# EAGLE schematic Zeus v2 (EAGLE 7.4.0)
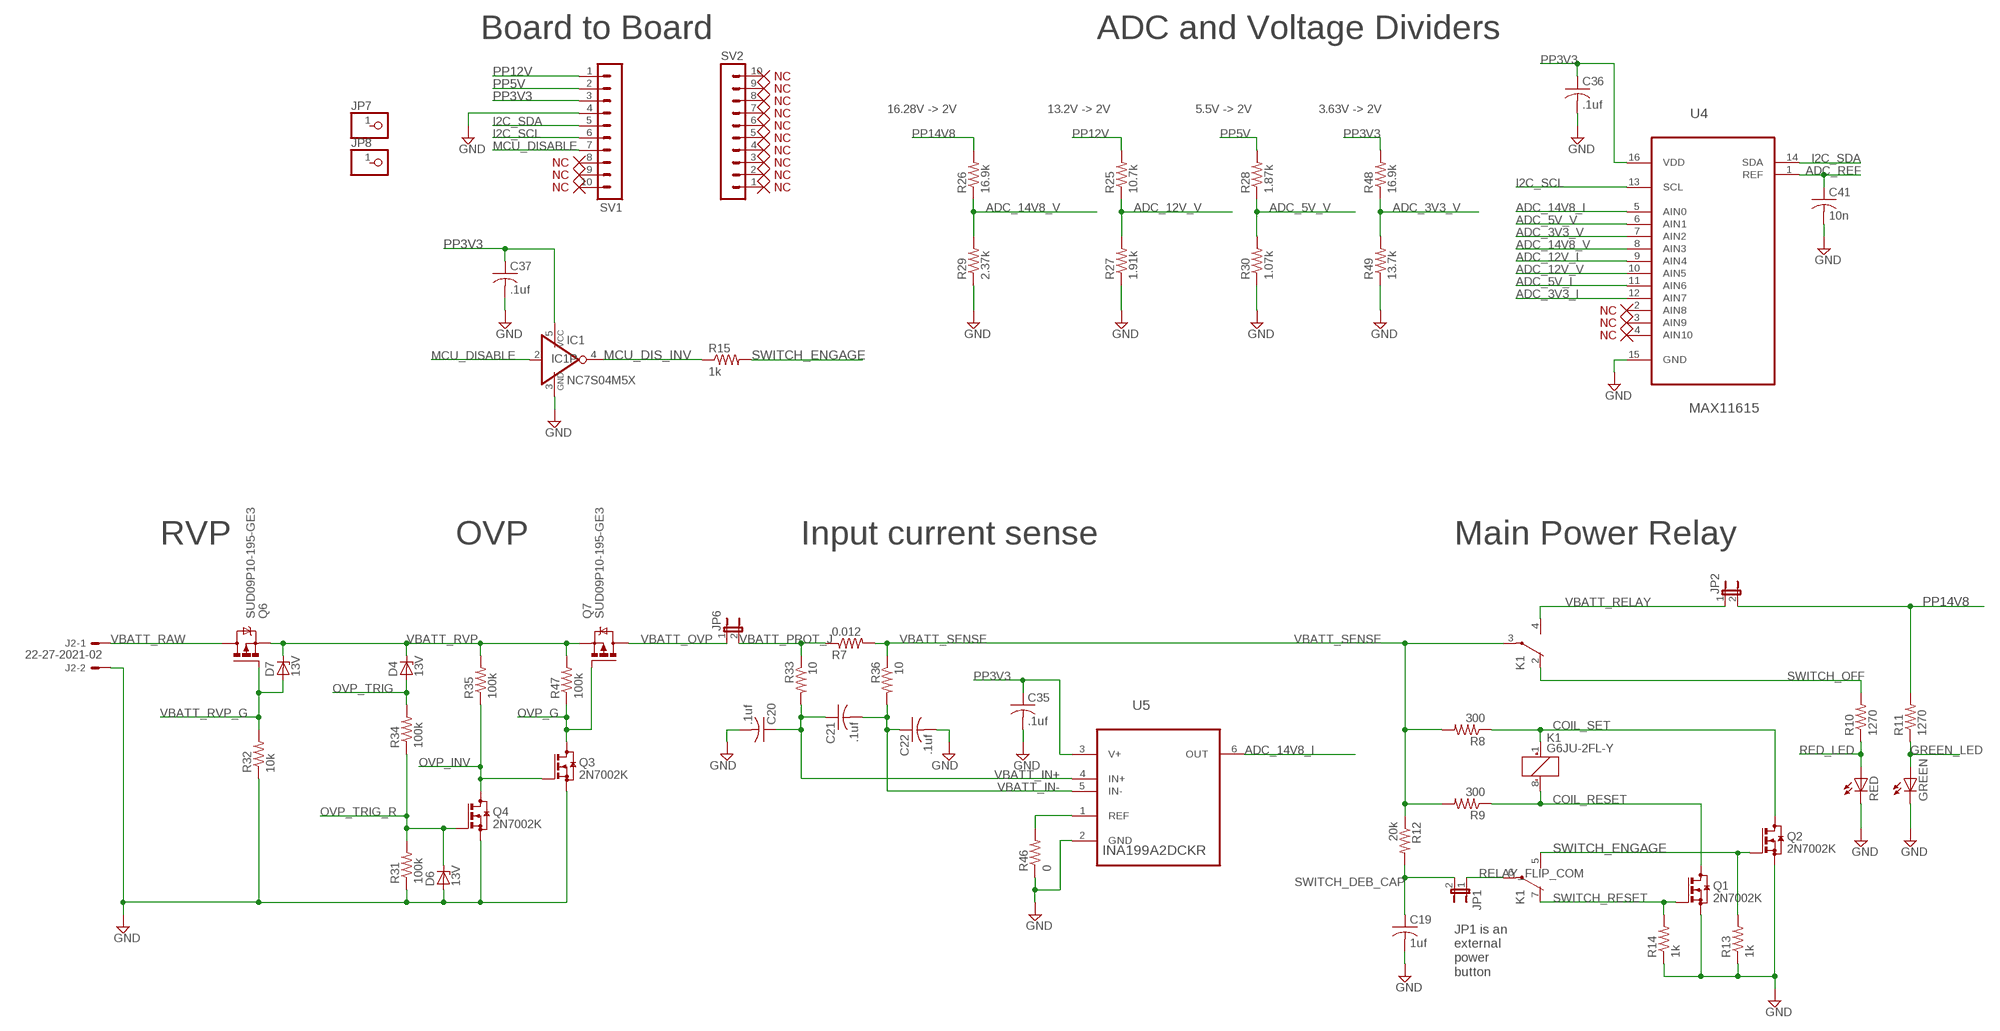
[diagram p0: schematic, sheet 1, part 1 of 2]
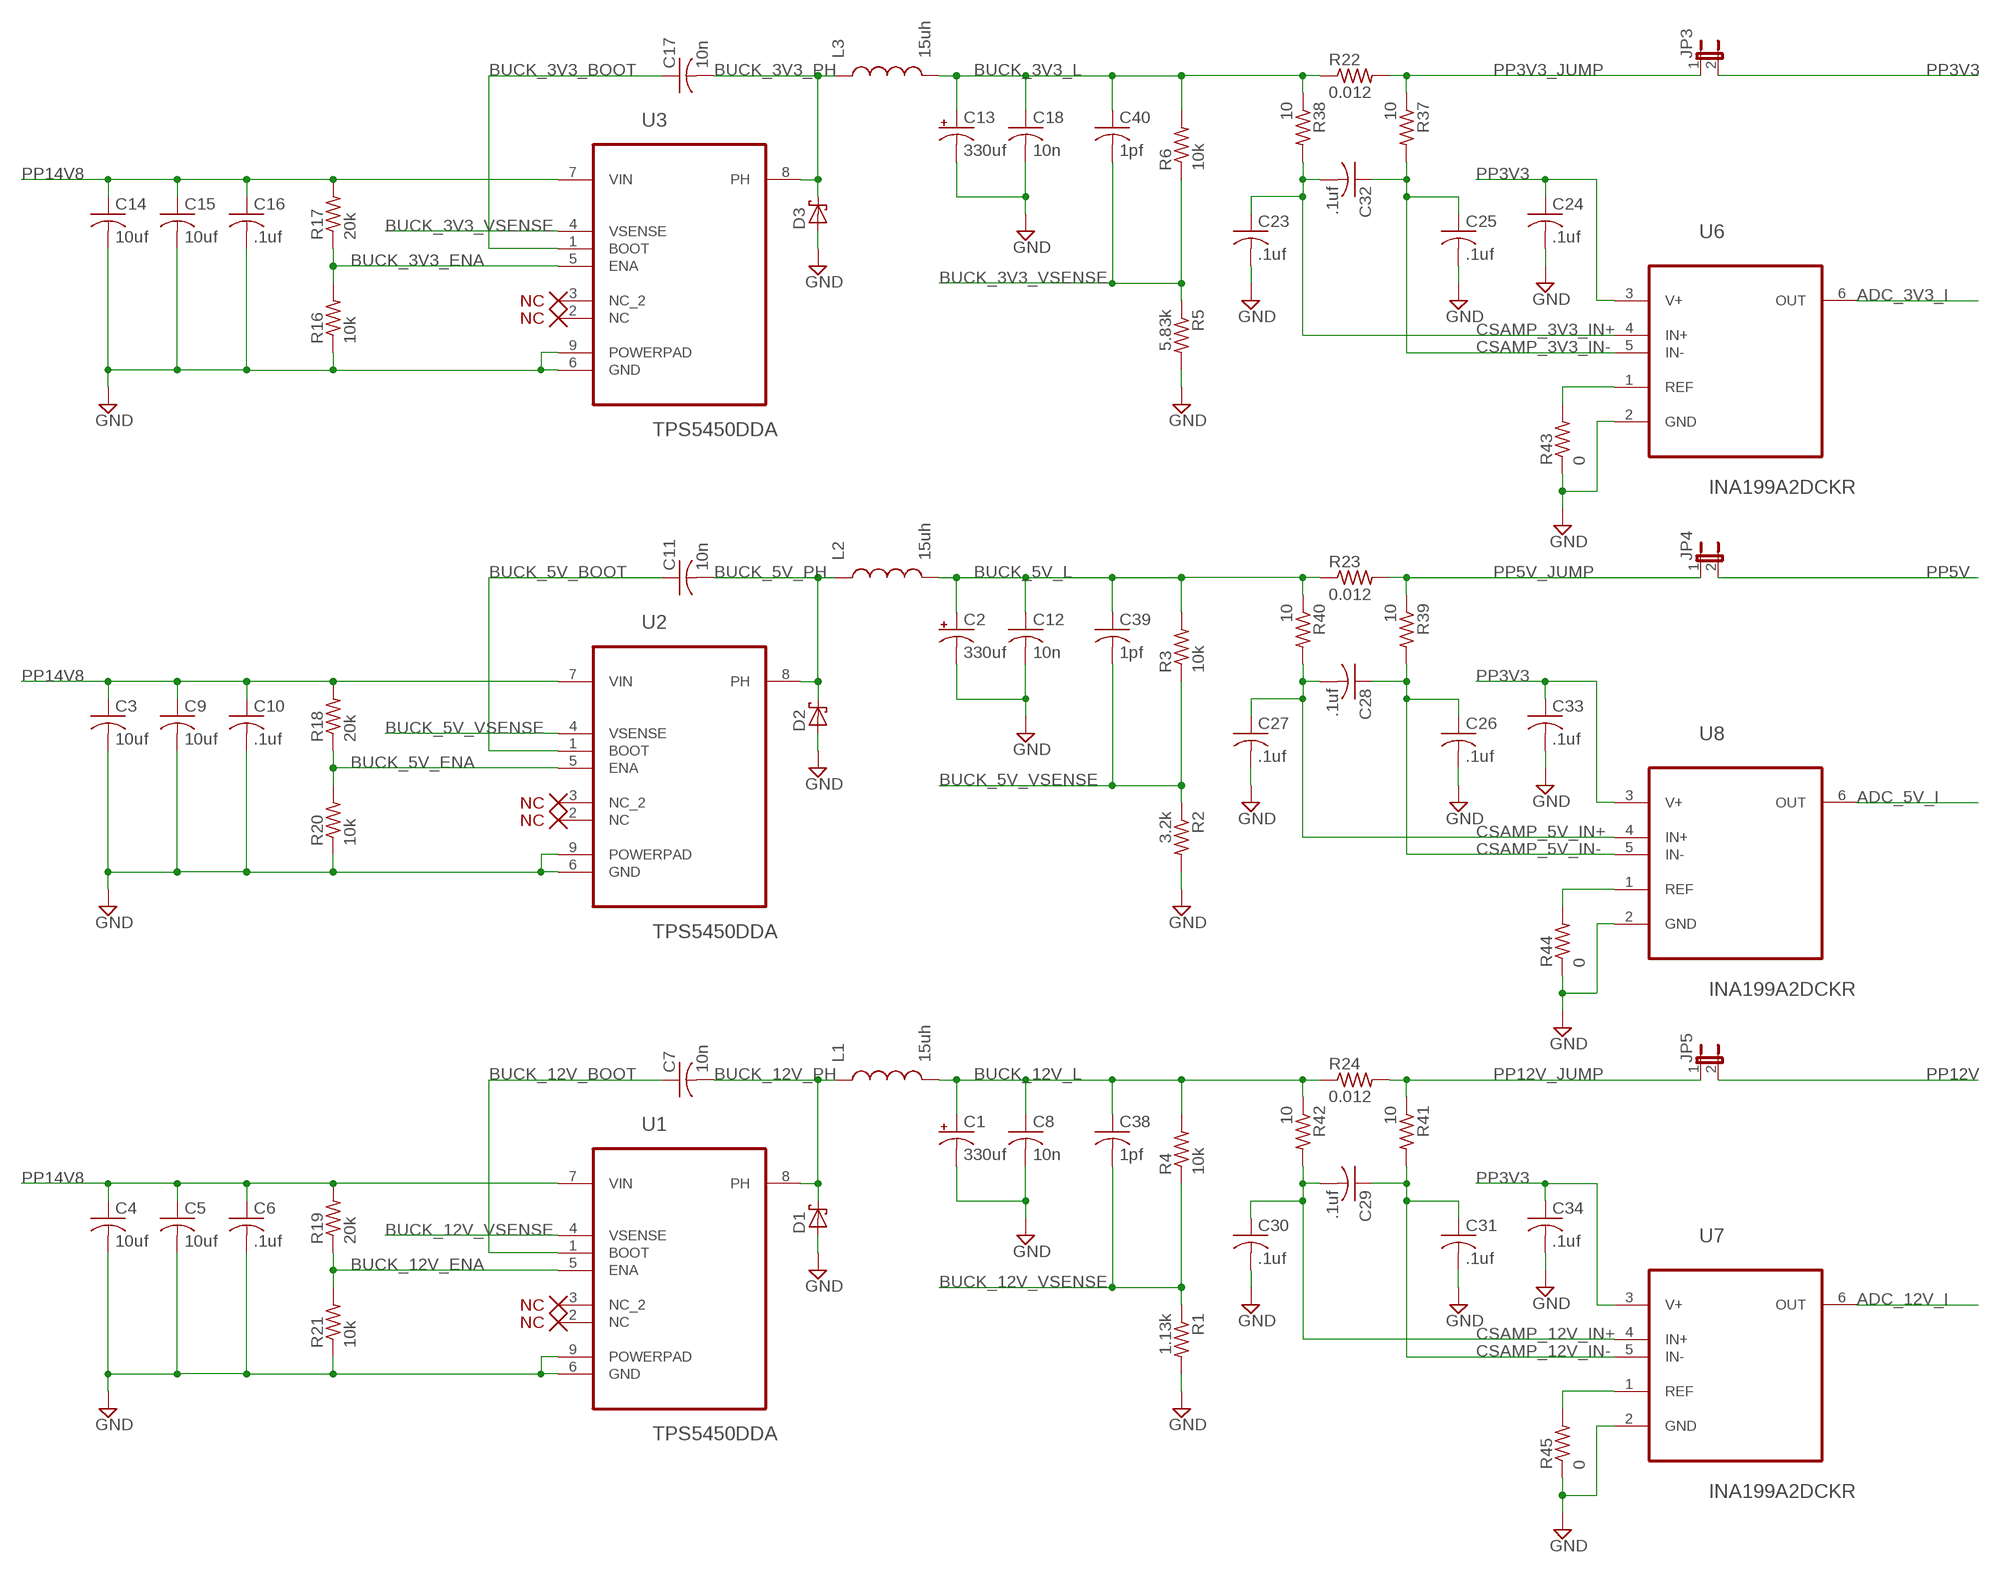
[diagram p1: schematic, sheet 1, part 2 of 2]

## Parts
C1  330uf  CPOL-US153CLV-0605  [153CLV-0605]
C2  330uf  CPOL-US153CLV-0605  [153CLV-0605]
C3  10uf  C-USC1206  [C1206]
C4  10uf  C-USC1206  [C1206]
C5  10uf  C-USC1206  [C1206]
C6  .1uf  C-USC0402  [C0402]
C7  10n  C-USC0402  [C0402]
C8  10n  C-USC0402  [C0402]
C9  10uf  C-USC1206  [C1206]
C10  .1uf  C-USC0402  [C0402]
C11  10n  C-USC0402  [C0402]
C12  10n  C-USC0402  [C0402]
C13  330uf  CPOL-US153CLV-0605  [153CLV-0605]
C14  10uf  C-USC1206  [C1206]
C15  10uf  C-USC1206  [C1206]
C16  .1uf  C-USC0402  [C0402]
C17  10n  C-USC0402  [C0402]
C18  10n  C-USC0402  [C0402]
C19  1uf  C-USC0603  [C0603]
C20  .1uf  C-USC0402  [C0402]
C21  .1uf  C-USC0402  [C0402]
C22  .1uf  C-USC0402  [C0402]
C23  .1uf  C-USC0402  [C0402]
C24  .1uf  C-USC0402  [C0402]
C25  .1uf  C-USC0402  [C0402]
C26  .1uf  C-USC0402  [C0402]
C27  .1uf  C-USC0402  [C0402]
C28  .1uf  C-USC0402  [C0402]
C29  .1uf  C-USC0402  [C0402]
C30  .1uf  C-USC0402  [C0402]
C31  .1uf  C-USC0402  [C0402]
C32  .1uf  C-USC0402  [C0402]
C33  .1uf  C-USC0402  [C0402]
C34  .1uf  C-USC0402  [C0402]
C35  .1uf  C-USC0402  [C0402]
C36  .1uf  C-USC0402  [C0402]
C37  .1uf  C-USC0402  [C0402]
C38  1pf  C-USC0402  [C0402]
C39  1pf  C-USC0402  [C0402]
C40  1pf  C-USC0402  [C0402]
C41  10n  C-USC0402  [C0402]
D1  SCHOTTKY-DIODESMC  [SMC]
D2  SCHOTTKY-DIODESMC  [SMC]
D3  SCHOTTKY-DIODESMC  [SMC]
D4  13V  ZENER-DIODESOT23  [SOT23]
D6  13V  ZENER-DIODESOT23  [SOT23]
D7  13V  ZENER-DIODESOT23  [SOT23]
GREEN  LED_ESML0603  [LED_SML0603]
IC1  NC7S04M5X  74AUC1G06DBV  [SOT23-5]
J2  22-27-2021-02  [6410-02]
JP1  JP1E  [JP1]
JP2  JP1E  [JP1]
JP3  JP1E  [JP1]
JP4  JP1E  [JP1]
JP5  JP1E  [JP1]
JP6  JP1E  [JP1]
JP7  PINHD-1X1  [1X01]
JP8  PINHD-1X1  [1X01]
K1  G6JU-2FL-Y  [G6J-2FL-Y]
L1  15uh  INDUCTOR  [SUMIDA]
L2  15uh  INDUCTOR  [SUMIDA]
L3  15uh  INDUCTOR  [SUMIDA]
Q1  2N7002K  BSS123  [SOT23]
Q2  2N7002K  BSS123  [SOT23]
Q3  2N7002K  BSS123  [SOT23]
Q4  2N7002K  BSS123  [SOT23]
Q6  SUD09P10-195-GE3  IRFR5305  [D-PAK_TO252AA]
Q7  SUD09P10-195-GE3  IRFR5305  [D-PAK_TO252AA]
R1  1.13k  R-US_R0603  [R0603]
R2  3.2k  R-US_R0603  [R0603]
R3  10k  R-US_R0603  [R0603]
R4  10k  R-US_R0603  [R0603]
R5  5.83k  R-US_R0603  [R0603]
R6  10k  R-US_R0603  [R0603]
R7  0.012  R-US_R0805  [R0805]
R8  300  R-US_R0603  [R0603]
R9  300  R-US_R0603  [R0603]
R10  1270  R-US_R0603  [R0603]
R11  1270  R-US_R0603  [R0603]
R12  20k  R-US_R0603  [R0603]
R13  1k  R-US_R0603  [R0603]
R14  1k  R-US_R0603  [R0603]
R15  1k  R-US_R0603  [R0603]
R16  10k  R-US_R0603  [R0603]
R17  20k  R-US_R0603  [R0603]
R18  20k  R-US_R0603  [R0603]
R19  20k  R-US_R0603  [R0603]
R20  10k  R-US_R0603  [R0603]
R21  10k  R-US_R0603  [R0603]
R22  0.012  R-US_R0805  [R0805]
R23  0.012  R-US_R0805  [R0805]
R24  0.012  R-US_R0805  [R0805]
R25  10.7k  R-US_R0603  [R0603]
R26  16.9k  R-US_R0603  [R0603]
R27  1.91k  R-US_R0603  [R0603]
R28  1.87k  R-US_R0603  [R0603]
R29  2.37k  R-US_R0603  [R0603]
R30  1.07k  R-US_R0603  [R0603]
R31  100k  R-US_R0603  [R0603]
R32  10k  R-US_R0603  [R0603]
R33  10  R-US_R0603  [R0603]
R34  100k  R-US_R0603  [R0603]
R35  100k  R-US_R0603  [R0603]
R36  10  R-US_R0603  [R0603]
R37  10  R-US_R0603  [R0603]
R38  10  R-US_R0603  [R0603]
R39  10  R-US_R0603  [R0603]
R40  10  R-US_R0603  [R0603]
R41  10  R-US_R0603  [R0603]
R42  10  R-US_R0603  [R0603]
R43  0  R-US_R0603  [R0603]
R44  0  R-US_R0603  [R0603]
R45  0  R-US_R0603  [R0603]
R46  0  R-US_R0603  [R0603]
R47  100k  R-US_R0603  [R0603]
R48  16.9k  R-US_R0603  [R0603]
R49  13.7k  R-US_R0603  [R0603]
RED  LED_ESML0603  [LED_SML0603]
SV1  MA10-1  [MA10-1]
SV2  MA10-1  [MA10-1]
U1  TPS5450DDA  [SOIC127P600X170-9N]
U2  TPS5450DDA  [SOIC127P600X170-9N]
U3  TPS5450DDA  [SOIC127P600X170-9N]
U4  MAX11615  MAX11602EEE+T  [SOP63P600X175-16N]
U5  INA199A2DCKR  [SOT65P210X110-6N]
U6  INA199A2DCKR  [SOT65P210X110-6N]
U7  INA199A2DCKR  [SOT65P210X110-6N]
U8  INA199A2DCKR  [SOT65P210X110-6N]

## Nets
ADC_3V3_I: U4.12(AIN7) U6.6(OUT)
ADC_3V3_V: R48.1 R49.2 U4.7(AIN2)
ADC_5V_I: U4.11(AIN6) U8.6(OUT)
ADC_5V_V: R28.1 R30.2 U4.6(AIN1)
ADC_12V_I: U4.9(AIN4) U7.6(OUT)
ADC_12V_V: R25.1 R27.2 U4.10(AIN5)
ADC_14V8_I: U4.5(AIN0) U5.6(OUT)
ADC_14V8_V: R26.1 R29.2 U4.8(AIN3)
ADC_REF: C41.1 U4.1(REF)
BUCK_3V3_BOOT: C17.1 U3.1(BOOT)
BUCK_3V3_ENA: R16.2 R17.1 U3.5(ENA)
BUCK_3V3_L: C13.+ C18.1 C40.1 L3.P$2 R6.2 R22.1 R38.1
BUCK_3V3_PH: C17.2 D3.C L3.P$1 U3.8(PH)
BUCK_3V3_VSENSE: C40.2 R5.1 R6.1 U3.4(VSENSE)
BUCK_5V_BOOT: C11.1 U2.1(BOOT)
BUCK_5V_ENA: R18.1 R20.2 U2.5(ENA)
BUCK_5V_L: C2.+ C12.1 C39.1 L2.P$2 R3.2 R23.1 R40.1
BUCK_5V_PH: C11.2 D2.C L2.P$1 U2.8(PH)
BUCK_5V_VSENSE: C39.2 R2.1 R3.1 U2.4(VSENSE)
BUCK_12V_BOOT: C7.1 U1.1(BOOT)
BUCK_12V_ENA: R19.1 R21.2 U1.5(ENA)
BUCK_12V_L: C1.+ C8.1 C38.1 L1.P$2 R4.2 R24.1 R42.1
BUCK_12V_PH: C7.2 D1.C L1.P$1 U1.8(PH)
BUCK_12V_VSENSE: C38.2 R1.1 R4.1 U1.4(VSENSE)
COIL_RESET: K1.8(1:-) Q1.3(D) R9.1
COIL_SET: K1.1(1:+) Q2.3(D) R8.1
CSAMP_3V3_IN+: C23.1 C32.2 R38.2 U6.4(IN+)
CSAMP_3V3_IN-: C25.1 C32.1 R37.2 U6.5(IN-)
CSAMP_3V3_REF: R43.2 U6.1(REF)
CSAMP_5V_IN+: C27.1 C28.2 R40.2 U8.4(IN+)
CSAMP_5V_IN-: C26.1 C28.1 R39.2 U8.5(IN-)
CSAMP_5V_REF: R44.2 U8.1(REF)
CSAMP_12V_IN+: C29.2 C30.1 R42.2 U7.4(IN+)
CSAMP_12V_IN-: C29.1 C31.1 R41.2 U7.5(IN-)
CSAMP_12V_REF: R45.2 U7.1(REF)
GND: C1.- C2.- C3.2 C4.2 C5.2 C6.2 C8.2 C9.2 C10.2 C12.2 C13.- C14.2 C15.2 C16.2 C18.2 C19.2 C20.2 C22.2 C23.2 C24.2 C25.2 C26.2 C27.2 C30.2 C31.2 C33.2 C34.2 C35.2 C36.2 C37.2 C41.2 D1.A D2.A D3.A D6.1(A) GREEN.C IC1.3(GND) J2.2 Q1.2(S) Q2.2(S) Q3.2(S) Q4.2(S) R1.2 R2.2 R5.2 R13.1 R14.1 R16.1 R20.1 R21.1 R27.1 R29.1 R30.1 R31.1 R32.1 R43.1 R44.1 R45.1 R46.1 R49.1 RED.C SV1.4 U1.6(GND) U1.9(POWERPAD) U2.6(GND) U2.9(POWERPAD) U3.6(GND) U3.9(POWERPAD) U4.15(GND) U5.2(GND) U6.2(GND) U7.2(GND) U8.2(GND)
GREEN_LED: GREEN.A R11.1
I2C_SCL: SV1.6 U4.13(SCL)
I2C_SDA: SV1.5 U4.14(SDA)
MCU_DIS_INV: IC1.4(O) R15.1
MCU_DISABLE: IC1.2(I) SV1.7
OPAMP_REF1: R46.2 U5.1(REF)
OVP_G: Q3.3(D) Q7.1(G) R47.1
OVP_INV: Q3.1(G) Q4.3(D) R35.1
OVP_TRIG: D4.1(A) R34.2
OVP_TRIG_R: D6.3(C) Q4.1(G) R31.2 R34.1
PP3V3: C24.1 C33.1 C34.1 C35.1 C36.1 C37.1 IC1.5(VCC) JP3.2 R48.2 SV1.3 U4.16(VDD) U5.3(V+) U6.3(V+) U7.3(V+) U8.3(V+)
PP3V3_JUMP: JP3.1 R22.2 R37.1
PP5V: JP4.2 R28.2 SV1.2
PP5V_JUMP: JP4.1 R23.2 R39.1
PP12V: JP5.2 R25.2 SV1.1
PP12V_JUMP: JP5.1 R24.2 R41.1
PP14V8: C3.1 C4.1 C5.1 C6.1 C9.1 C10.1 C14.1 C15.1 C16.1 JP2.2 R11.2 R17.2 R18.2 R19.2 R26.2 U1.7(VIN) U2.7(VIN) U3.7(VIN)
RED_LED: R10.1 RED.A
RELAY_FLIP_COM: JP1.1 K1.6(3:P)
SWITCH_DEB_CAP: C19.1 JP1.2 R12.2
SWITCH_ENGAGE: K1.5(3:S) Q2.1(G) R13.2 R15.2
SWITCH_OFF: K1.2(2:O) R10.2
SWITCH_RESET: K1.7(3:O) Q1.1(G) R14.2
VBATT_IN+: C20.1 C21.1 R33.2 U5.4(IN+)
VBATT_IN-: C21.2 C22.1 R36.2 U5.5(IN-)
VBATT_OVP: JP6.1 Q7.4(D)
VBATT_PROT_J: JP6.2 R7.1 R33.1
VBATT_RAW: J2.1 Q6.4(D)
VBATT_RELAY: JP2.1 K1.4(2:S)
VBATT_RVP: D4.3(C) D7.3(C) Q6.3(S) Q7.3(S) R35.2 R47.2
VBATT_RVP_G: D7.1(A) Q6.1(G) R32.2
VBATT_SENSE: K1.3(2:P) R7.2 R8.2 R9.2 R12.1 R36.1
Unconnected: JP7.1 JP8.1 SV1.8 SV1.9 SV1.10 SV2.1 SV2.2 SV2.3 SV2.4 SV2.5 SV2.6 SV2.7 SV2.8 SV2.9 SV2.10 U1.2(NC) U1.3(NC_2) U2.2(NC) U2.3(NC_2) U3.2(NC) U3.3(NC_2) U4.2(AIN8) U4.3(AIN9) U4.4(AIN10)

## Notes on the sheet
- Board to Board | ADC and Voltage Dividers
- 16.28V -> 2V | 13.2V -> 2V | 5.5V -> 2V | 3.63V -> 2V
- RVP | OVP | Input current sense | Main Power Relay
- JP1 is an 
  external 
  power 
  button

## Library data of the parts
C1 C2 C13 = rcl:CPOL-US: POLARIZED CAPACITOR, American symbol
C3-C12 C14-C41 = rcl:C-US: CAPACITOR, American symbol
D1-D3 = diode:SCHOTTKY-DIODE: Schottky Diode
D4 D6 D7 = diode:ZENER-DIODE: Z-Diode
GREEN RED = eagle-ltspice:LED_E: LED Source: http://www.osram.convergy.de Source: www.luxeon.com Source: www.kingbright.com; SPICEMODEL: NONE; SPICEPREFIX: D; SPICETYPE: diode
IC1 = 74xx-little-de:74*1G06: Single Inverter Buffer/Driver With Open-Drain Output
J2 = con-molex:22-?-02: CONNECTOR wire to board 2.54 mm (.1 inch) pitch header; OC_FARNELL: unknown; OC_NEWARK: unknown
JP1-JP6 = jumper:JP1E: JUMPER
JP7 JP8 = pinhead:PINHD-1X1: PIN HEADER
K1 = relay:G6J*-2?-Y: Surface-Mounting Signal Relay - G6J-Y 5.7 x 10.6 x 9 mm Source: http://www.omroncomponents.eu/ .. K125-E2-02-X.pdf; MPN: G6JU-2FL-Y DC3; OC_FARNELL: unknown; OC_NEWARK: 04M9916
L1-L3 = CUSTOM:INDUCTOR
Q1-Q4 = transistor-small-signal:BSS123: N-CHANNEL MOS FET
Q6 Q7 = transistor-power:IRF?5305: HEXFET Power MOSFET Source: http://www.irf.com/product-info/datasheets/data/irfr5305pbf.pdf
R1-R6 R8-R21 R25 R27 R28 R30-R49 = rcl:R-US_: RESISTOR, American symbol
R7 R22-R24 R26 R29 = resistor:R-US_: RESISTOR, American symbol
SV1 SV2 = con-lstb:MA10-1: PIN HEADER; OC_FARNELL: unknown; OC_NEWARK: unknown
U1-U3 = Texas Instruments_By_element14_Batch_1:TPS5450DDA: 5-A, WIDE INPUT RANGE, STEP-DOWN SWIFT CONVERTER; MPN: TPS5450DDA; OC_FARNELL: 1564960; OC_NEWARK: 37M0059; PACKAGE: SOIC-8; SUPPLIER: TEXAS INSTRUMENTS
U4 = Maxim_By_element14_Batch_1:MAX11602EEE+T: 4.5V to 5.5V Low-Power 8-Channel 2-Wire Serial 8-Bit ADCs; MPN: MAX11602EEE+T; OC_FARNELL: -; OC_NEWARK: 09R0346; PACKAGE: QSOP-16; SUPPLIER: Maxim
U5-U8 = Texas Instruments_By_element14_Batch_1:INA199A2DCKR: CURRENT SHUNT MONITOR; MPN: INA199A2DCKR; OC_FARNELL: -; OC_NEWARK: 74R6385; PACKAGE: SC70-6; SUPPLIER: Texas Instruments